# Altium schematic sheet Zynq.SchDoc
size Tabloid; ApprovedBy: NA
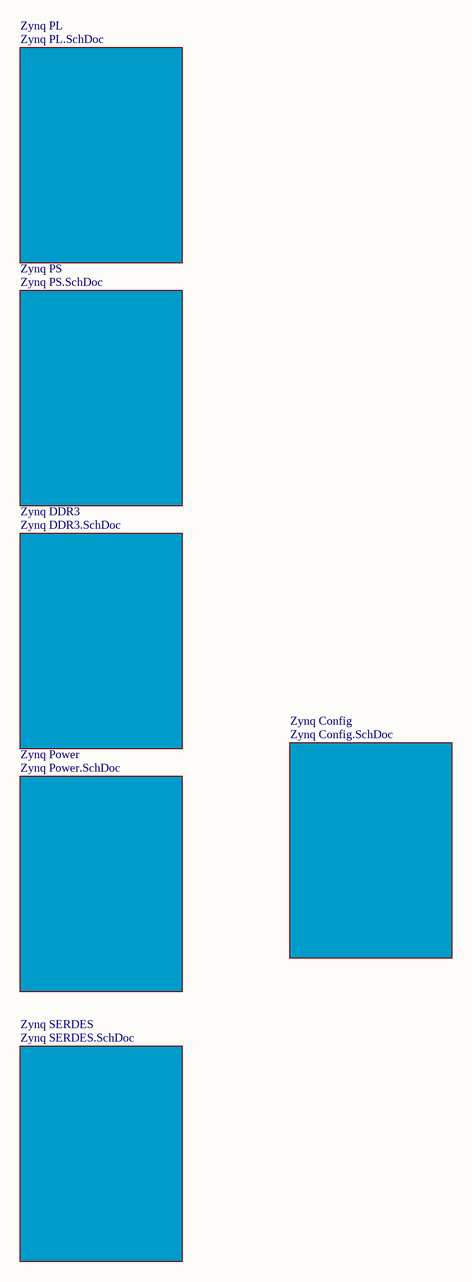
[diagram p0: Zynq.SchDoc]

## Sub-sheets
Zynq Config = Zynq Config.SchDoc: no entries
Zynq DDR3 = Zynq DDR3.SchDoc: no entries
Zynq PL = Zynq PL.SchDoc: no entries
Zynq Power = Zynq Power.SchDoc: no entries
Zynq PS = Zynq PS.SchDoc: no entries
Zynq SERDES = Zynq SERDES.SchDoc: no entries

## Notes on the sheet
- Project:
- http://www.cospandesign.com
- Cospan Design
- Document:
- Engineer:
- Title:
- Client:
- Approved By:
- Revision:
- Date:
- Number:
- of